# Altium schematic sheet MONOPLACA FINAL.SchDoc
size A4
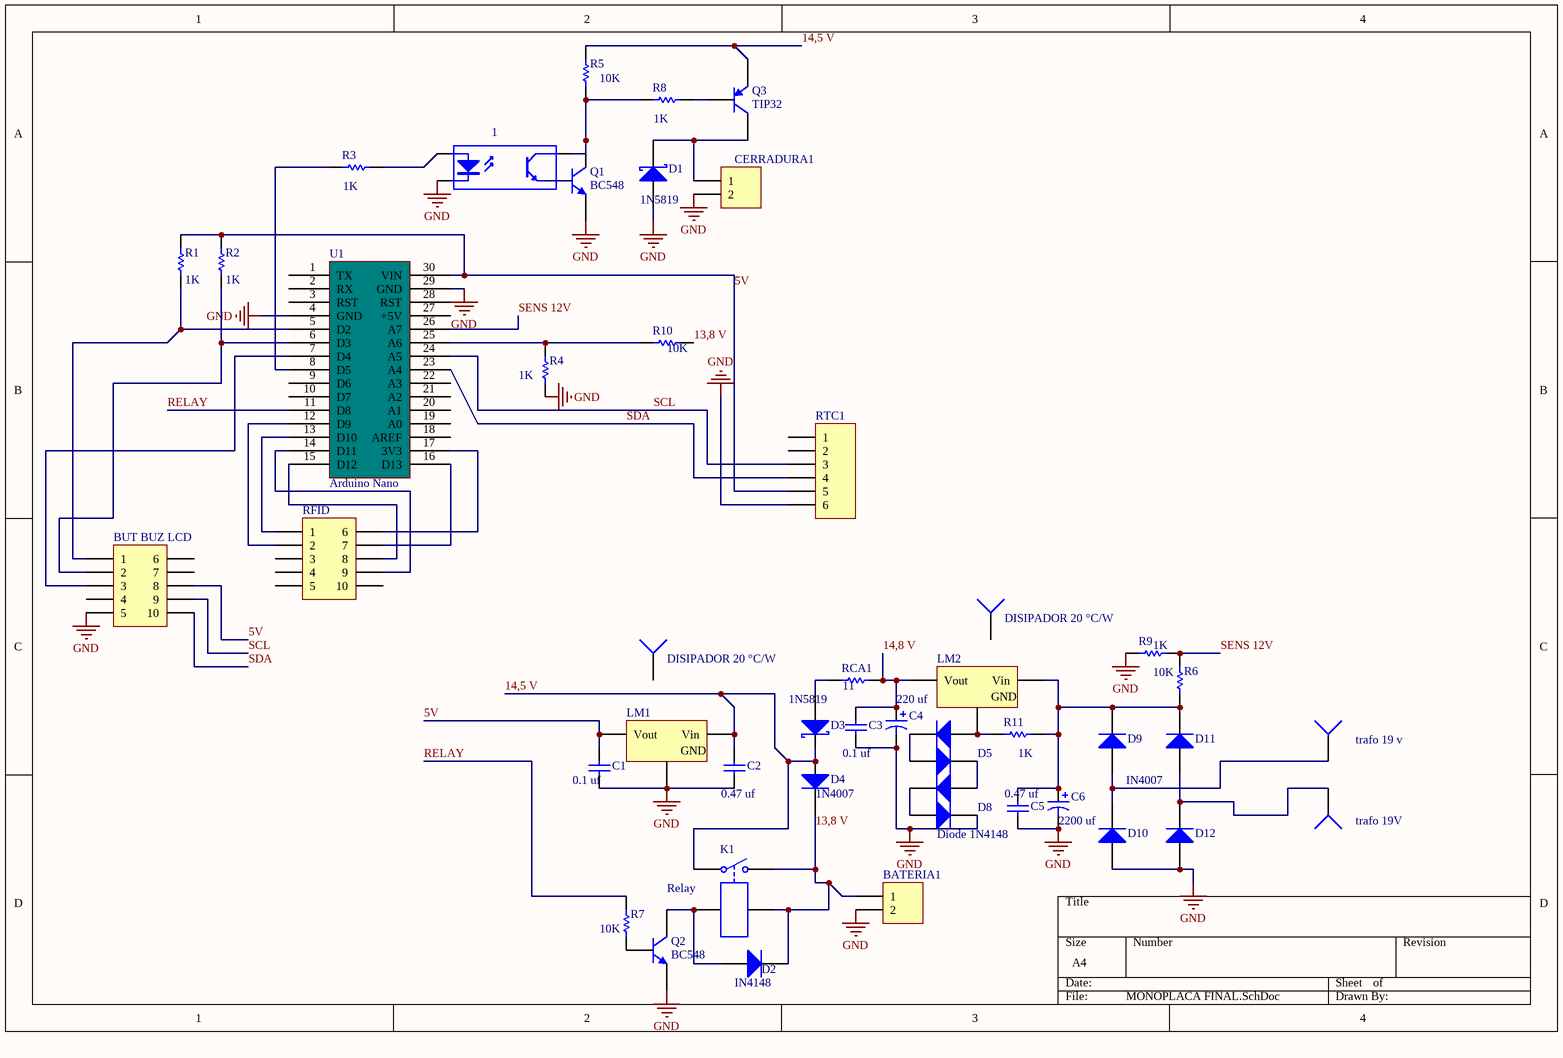
[diagram p0: MONOPLACA FINAL.SchDoc]

## Parts
1  4N25  [DIP-6]  (value not drawn)
BATERIA1  Header 2  [Bornera 2 pin]  (value not drawn)
BUT_BUZ_LCD  Header 5X2A  [HDR2X5_CEN]  (value not drawn)
C1  value 0.1 uf  [CAP 5x12 mm]  (hidden comment: Cap)
C2  value 0.47 uf  [CAP 12x10 mm]  (hidden comment: Cap)
C3  value 0.1 uf  [CAP 5x12 mm]  (hidden comment: Cap)
C4  value 220 uf  [CAP POL 3 - 8 mm]  (hidden comment: Cap Pol1)
C5  value 0.47 uf  [CAP 12x10 mm]  (hidden comment: Cap)
C6  value 2200 uf  [CAP POL 18x7 mm]  (hidden comment: Cap Pol1)
CERRADURA1  Header 2  [Bornera 2 pin]  (value not drawn)
D1  1N5819  [DO-41]
D2  IN4148  [DO-35]
D3  1N5819  [DO-41]
D4  1N4007  [DO-41]
D5  Diode 1N914  [DO-35]  (value not drawn)
D6  Diode 1N914  [DO-35]  (value not drawn)
D7  Diode 1N914  [DO-35]  (value not drawn)
D8  Diode 1N4148  [DO-35]
D9  IN4007  [DO-41]
D10  IN4007  [DO-41]  (value not drawn)
D11  IN4007  [DO-41]  (value not drawn)
D12  IN4007  [DO-41]  (value not drawn)
DISIPADOR_1  DISIPADOR 20 °C/W  [DISIPADOR 20 C°/W]
DISIPADOR_2  DISIPADOR 20 °C/W  [DISIPADOR 20 C°/W]
J1  trafo 19V  [PIN1]
J2  trafo 19 v  [PIN1]
K1  Relay  [RELE]
LM1  LM7805  [TO-220AB]  (value not drawn)
LM2  LM7812  [TO-220AB]  (value not drawn)
Q1  BC548  [TO-92-MOD]
Q2  BC548  [TO-92-MOD]
Q3  TIP32  [TO-220AB]
R1  value 1K  [RESISTENCIA 0.25 W]  (hidden comment: Res1)
R2  value 1K  [RESISTENCIA 0.25 W]  (hidden comment: Res1)
R3  value 1K  [RESISTENCIA 0.25 W]  (hidden comment: Res1)
R4  value 1K  [RESISTENCIA 0.25 W]  (hidden comment: Res1)
R5  value 10K  [RESISTENCIA 0.25 W]  (hidden comment: Res1)
R6  value 10K  [RESISTENCIA 0.25 W]  (hidden comment: Res1)
R7  value 10K  [RESISTENCIA 0.25 W]  (hidden comment: Res1)
R8  value 1K  [RESISTENCIA 0.25 W]  (hidden comment: Res1)
R9  value 1K  [RESISTENCIA 0.25 W]  (hidden comment: Res1)
R10  value 10K  [RESISTENCIA 0.25 W]  (hidden comment: Res1)
R11  value 1K  [RESISTENCIA 0.25 W]  (hidden comment: Res1)
RCA1  value 11  [RESISTENCIA 5W]  (hidden comment: Res1)
RFID  Header 5X2A  [HDR2X5_CEN]  (value not drawn)
RTC1  Header 6  [HDR1X6]  (value not drawn)
U1  Arduino Nano  [Arduino nano]

## Nets
GND: 1.2(K) BATERIA1.2 BUT_BUZ_LCD.5 C1.1 C2.1 C3.1 C4.2 C5.1 C6.2 CERRADURA1.2 D1.1(A) D8.2(K) D10.1(A) D12.1(A) LM1.2(GND) Q1.1(E) Q2.3(E) R4.1 R9.1 RTC1.6 U1.4(GND) U1.29(GND)
5V: BUT_BUZ_LCD.8 C1.2 LM1.3(Vout) R1.2 R2.2 RTC1.5 U1.30(VIN)
13,8 V: BATERIA1.1 D2.2(K) D4.2(K) K1.2 K1.4 R10.2
14,5 V: C2.2 D3.2(K) D4.1(A) K1.1 LM1.1(Vin) Q3.1(E) R5.2
14,8 V: C3.2 C4.1 LM2.3(Vout) RCA1.2
RELAY: R7.1 U1.11(D8)
SCL: BUT_BUZ_LCD.9 RTC1.3 U1.24(A5)
SDA: BUT_BUZ_LCD.10 RTC1.4 U1.23(A4)
SENS 12V: R6.2 R9.2 U1.26(A7)
Net1_1: 1.1(A) R3.2
Net1_3: 1.3(E) Q1.2(B)
Net1_4: 1.4(C) Q1.3(C) R5.1 R8.1
NetBUT_BUZ_LCD_1: BUT_BUZ_LCD.1 R1.1 U1.5(D2)
NetBUT_BUZ_LCD_2: BUT_BUZ_LCD.2 R2.1 U1.6(D3)
NetBUT_BUZ_LCD_3: BUT_BUZ_LCD.3 U1.7(D4)
NetC5_2: C5.2 C6.1 D9.2(K) D11.2(K) LM2.1(Vin) R6.1 R11.2
NetCERRADURA1_1: CERRADURA1.1 D1.2(K) Q3.3(C)
NetD2_1: D2.1(A) K1.3 Q2.1(C)
NetD3_1: D3.1(A) RCA1.1
NetD5_1: D5.1(A) LM2.2(GND) R11.1
NetD5_2: D5.2(K) D6.1(A)
NetD6_2: D6.2(K) D7.1(A)
NetD7_2: D7.2(K) D8.1(A)
NetD9_1: D9.1(A) D10.2(K) J2.1
NetD11_1: D11.1(A) D12.2(K) J1.1
NetQ2_2: Q2.2(B) R7.2
NetQ3_2: Q3.2(B) R8.2
NetR3_1: R3.1 U1.8(D5)
NetR4_2: R4.2 R10.1 U1.25(A6)
NetRFID_1: RFID.1 U1.13(D10)
NetRFID_2: RFID.2 U1.12(D9)
NetRFID_6: RFID.6 U1.17(3V3)
NetRFID_7: RFID.7 U1.16(D13)
NetRFID_8: RFID.8 U1.15(D12)
NetRFID_9: RFID.9 U1.14(D11)

Not connected (* = marked no-connect by the designer): BUT_BUZ_LCD 4 6 7; DISIPADOR_1 1; DISIPADOR_2 1; RFID 3 4 5 10; RTC1 1 2; U1 1(TX) 2(RX) 3(RST) 9(D6) 10(D7) 18(AREF) 19(A0) 20(A1) 21(A2) 22(A3) 27(+5V) 28(RST)

## Library data of the parts
1 = Optoisolator1: 4-Pin Phototransistor Optocoupler; pin to pad: 3>4 4>5; Published: 24-Mar-1999; LatestRevisionDate: 04-Mar-2005; LatestRevisionNote: Sch pins 3 & 4 Swapped.; DatasheetVersion: Nov-2003; PackageReference: DIP-4; Publisher: Altium Limited
BATERIA1 = Header 2: Header, 2-Pin; LatestRevisionDate: 17-Jul-2002; LatestRevisionNote: Re-released for DXP Platform.; Publisher: Altium Limited
BUT_BUZ_LCD RFID = Header 5X2A: Header, 5-Pin, Dual row; LatestRevisionDate: 17-Jul-2002; LatestRevisionNote: Re-released for DXP Platform.; Publisher: Altium Limited
C1-C3 C5 = Cap: Capacitor; Published: 8-Jun-2000; LatestRevisionDate: 17-Jul-2002; LatestRevisionNote: Re-released for DXP Platform.; PackageReference: RAD-0.3; Publisher: Altium Limited; PackageDescription: Radial Cap, Thru-Hole; 2 Leads; 0.3 in Pin Spacing
C4 C6 = Cap Pol1: Polarized Capacitor (Radial); Published: 8-Jun-2000; LatestRevisionDate: 17-Jul-2002; LatestRevisionNote: Re-released for DXP Platform.; PackageReference: RB7.6-15; Publisher: Altium Limited; PackageDescription: Polarized Capacitor (Radial); 2 Leads
CERRADURA1 = Header 2: Header, 2-Pin; pin to pad: 1>2 2>1; LatestRevisionDate: 17-Jul-2002; LatestRevisionNote: Re-released for DXP Platform.; Publisher: Altium Limited
D1 D3 = D Schottky: Schottky Diode; Published: 8-Jun-2000; LatestRevisionDate: 17-Jul-2002; LatestRevisionNote: Re-released for DXP Platform.; PackageReference: SMB; Publisher: Altium Limited; PackageDescription: DO-214-AA/SMB; 2 C-Bend Leads; Body 5.3 x 3.6 mm, inc. leads (LxW); Code_JEDEC: DO-214-AA
D2 D4-D12 = Diode 1N914: High Conductance Fast Diode; Published: 8-Jun-2000; LatestRevisionDate: 17-Jul-2002; LatestRevisionNote: Re-released for DXP Platform.; DatasheetVersion: 1997; PackageReference: DO-35; Publisher: Altium Limited; PackageDescription: Diode, Axial; Body 3.8 x 1.9 mm (LxDia. max), Lead Dia. 0.53 mm (max); Code_JEDEC: DO-204-AH; ComponentLink1Description: Manufacturer Link; ComponentLink1URL: http://www.fairchildsemi.com/; ComponentLink2Description: Datasheet; ComponentLink2URL: http://www.fairchildsemi.com/ds/1N%2F1N4448.pdf
DISIPADOR_1 DISIPADOR_2 J1 J2 = Socket: LatestRevisionDate: 17-Jul-2002; LatestRevisionNote: Re-released for DXP Platform.; Publisher: Altium Limited
K1 = Relay-SPST: Single-Pole Single-Throw Relay; pin to pad: 1>5 2>4 4>2; Published: 24-Mar-1999; LatestRevisionDate: 17-Jul-2002; LatestRevisionNote: Re-released for DXP Platform.; PackageReference: MODULE4; Publisher: Altium Limited
LM1 LM2 = Volt Reg: Voltage Regulator; Published: 24-Mar-1999; LatestRevisionDate: 29-May-2009; LatestRevisionNote: IPC-7351 Footprint Added.; PackageReference: D2PAK; Publisher: Altium Limited; PackageDescription: 3-Pin Transistor Outline Package 2.54 mm Pitch, 15.1 mm Lead Span
Q1 = 2N3904: NPN General Purpose Amplifier; pin to pad: 1>3 3>1; Published: 8-Jun-2000; LatestRevisionDate: 15-Jan-2003; LatestRevisionNote: PCB Footprint 'BCY-W3/D4.7' replaced; DatasheetVersion: 1997; PackageVersion: Sep-1998; PackageReference: TO-92A; Publisher: Altium Limited; PackageDescription: TO, Flat Index; 3 In-Line, Axial Leads; Body Dia. 4.5mm; Leads 0.51 x 0.48 mm (max); ComponentLink1Description: Manufacturer Link; ComponentLink1URL: http://www.fairchildsemi.com/; ComponentLink2Description: Datasheet; ComponentLink2URL: http://www.fairchildsemi.com/ds/2N%2F2N3904.pdf
Q2 = NPN: NPN Bipolar Transistor; Published: 8-Jun-2000; LatestRevisionDate: 17-Jul-2002; LatestRevisionNote: Re-released for DXP Platform.; PackageReference: TO-226-AA; Publisher: Altium Limited; PackageDescription: TO, Flat Index; 3 In-Line, Axial Leads; Body Dia. 4.8mm; Leads 0.55 x 0.51 mm (max); Code_JEDEC: TO-226-AA
Q3 = 2N3906: PNP General Purpose Amplifier; pin to pad: 1>3 2>1 3>2; Published: 8-Jun-2000; LatestRevisionDate: 15-Jan-2003; LatestRevisionNote: PCB Footprint 'BCY-W3/D4.7' replaced; DatasheetVersion: 1997; PackageVersion: Sep-1998; PackageReference: TO-92A; Publisher: Altium Limited; PackageDescription: TO, Flat Index; 3 In-Line, Axial Leads; Body Dia. 4.5mm; Leads 0.51 x 0.48 mm (max); ComponentLink1Description: Manufacturer Link; ComponentLink1URL: http://www.fairchildsemi.com/; ComponentLink2Description: Datasheet; ComponentLink2URL: http://www.fairchildsemi.com/ds/2N%2F2N3906.pdf
R1-R11 RCA1 = Res1: Resistor; Published: 8-Jun-2000; LatestRevisionDate: 17-Jul-2002; LatestRevisionNote: Re-released for DXP Platform.; PackageReference: AXIAL-0.3; Publisher: Altium Limited; PackageDescription: Axial Device, Thru-Hole; 2 Leads; 0.3 in Pin Spacing
RTC1 = Header 6: Header, 6-Pin; LatestRevisionDate: 17-Jul-2002; LatestRevisionNote: Re-released for DXP Platform.; Publisher: Altium Limited
U1 = Component_1: pin to pad: 1>30 2>29 3>28 4>27 5>20 6>25 7>24 8>23 9>22 10>21 11>26 12>19 13>18 14>17 15>16 16>15 17>14 18>13 19>12 20>11 21>10 22>9 23>8 24>7 25>6 26>5 27>4 28>3 29>2 30>1